# EAGLE schematic 13thISE.ver1 (EAGLE 9.6.2)
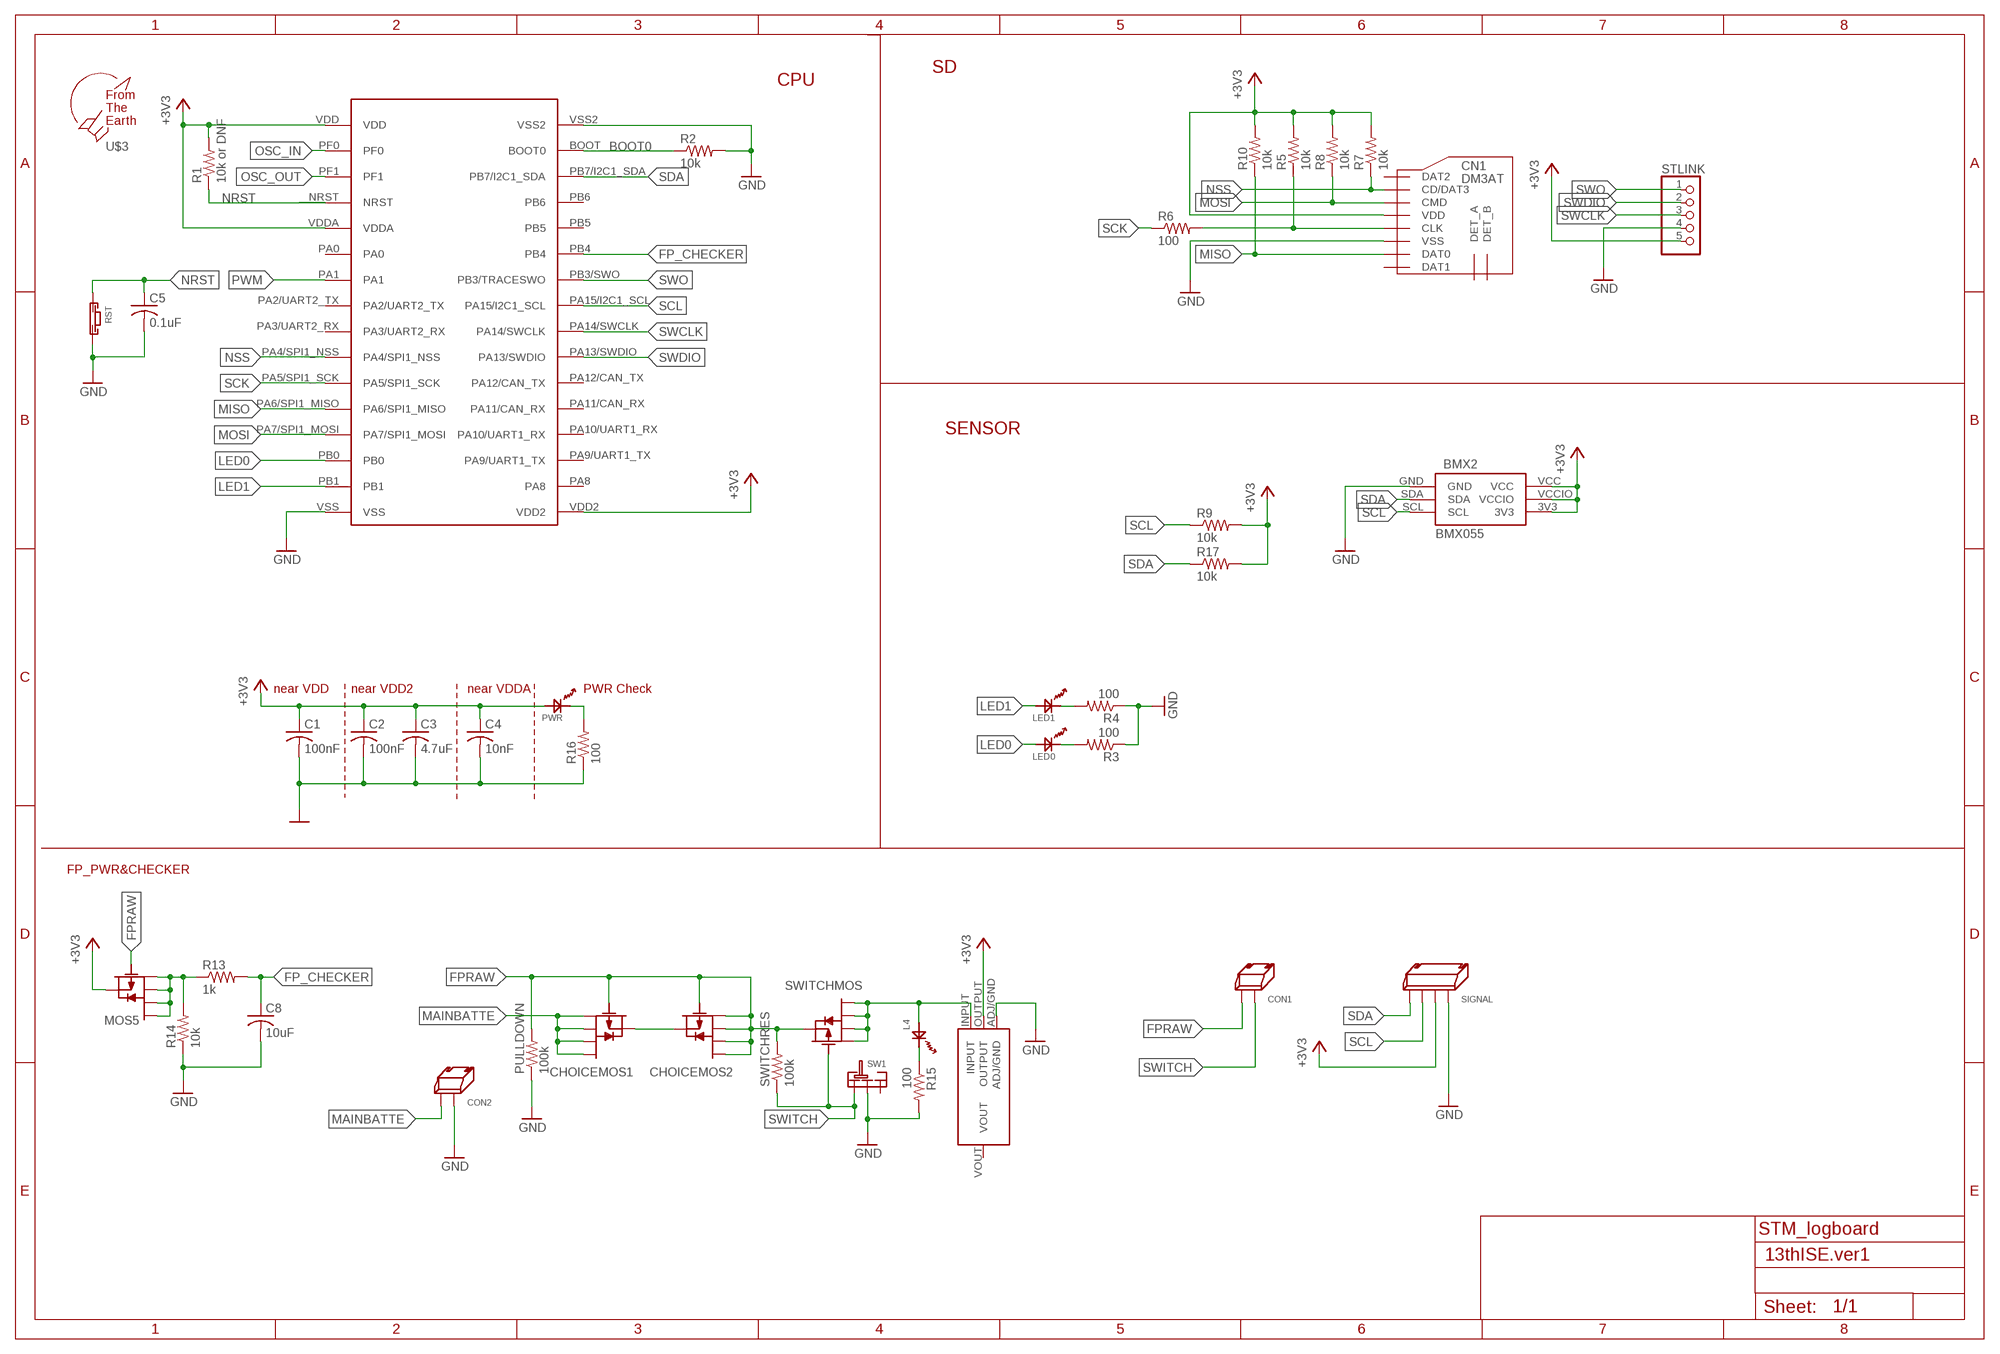
[diagram p0: schematic, sheet 1]

## Parts
BMX2  BMX055  [BMX055]
C1  100nF  C-USC1608  [C1608]
C2  100nF  C-USC1608  [C1608]
C3  4.7uF  C-USC1608  [C1608]
C4  10nF  C-USC1608  [C1608]
C5  0.1uF  C-USC1608  [C1608]
C8  10uF  C-USC0603  [C0603]
CHOICEMOS1  PCH_SSM6J808R  [SSM6J808R]
CHOICEMOS2  PCH_SSM6J808R  [SSM6J808R]
CN1  DM3AT  [DM3AT]
CON1  2PIN_SIDE  [2PIN_SIDE]
CON2  2PIN_SIDE  [2PIN_SIDE]
L4  OSXX1608C1A  [OSXX1608C1A]
LED0  OSXX1608C1A  [OSXX1608C1A]
LED1  OSXX1608C1A  [OSXX1608C1A]
MOS5  PCH_SSM6J808R  [SSM6J808R]
PULLDOWN  100k  R-US_R0603  [R0603]
PWR  OSXX1608C1A  [OSXX1608C1A]
R1  10k or DNF  R-US_R0603  [R0603]
R2  10k  R-US_R0603  [R0603]
R3  100  R-US_R0603  [R0603]
R4  100  R-US_R0603  [R0603]
R5  10k  R-US_R0603  [R0603]
R6  100  R-US_R0603  [R0603]
R7  10k  R-US_R0603  [R0603]
R8  10k  R-US_R0603  [R0603]
R9  10k  R-US_R0603  [R0603]
R10  10k  R-US_R0603  [R0603]
R13  1k  R-US_R0603  [R0603]
R14  10k  R-US_R0603  [R0603]
R15  100  R-US_R0603  [R0603]
R16  100  R-US_R0603  [R0603]
R17  10k  R-US_R0603  [R0603]
RST  TVAF06-A020B-R  [TVAF06-A020B-R]
SIGNAL  4PIN_SIDE  [4PIN_SIDE]
STLINK  PINHD-1X5/90  [1X05/90]
SW1  SRIDE_SWITCH  [SRIDE_SWITCH]
SWITCHMOS  PCH_SSM6J808R  [SSM6J808R]
SWITCHRES  100k  R-US_R0603  [R0603]
U$1  STM32F303K8  [STM32F303K8]
U$3  F.T.E.LOGO  [LOGO]
U$4  AZ1117C  [AZ1117C]

## Nets
+3V3: BMX2.3V3 BMX2.VCC BMX2.VCCIO C1.1 C2.1 C3.1 C4.1 CN1.VDD MOS5.4 PWR.AN R1.2 R5.2 R7.2 R8.2 R9.2 R10.2 R17.2 SIGNAL.P$3 STLINK.5 U$1.VDD U$1.VDD2 U$1.VDDA U$4.OUTPUT
BOOT0: R2.1 U$1.BOOT(BOOT0)
FP_CHECKER: C8.1 R13.2 U$1.PB4
FPRAW: CHOICEMOS1.3 CHOICEMOS2.1 CHOICEMOS2.2 CHOICEMOS2.3 CHOICEMOS2.5 CHOICEMOS2.6 CON1.P$2 MOS5.3 PULLDOWN.2 SWITCHMOS.4 SWITCHRES.2
GND: BMX2.GND C1.2 C2.2 C3.2 C4.2 C5.2 C8.2 CN1.VSS CON2.P$1 PULLDOWN.1 R2.2 R3.1 R4.1 R14.1 R15.2 R16.1 RST.P$2 SIGNAL.P$4 STLINK.4 SW1.LR U$1.VSS U$1.VSS2 U$4.ADJ/GND
LED0: LED0.AN U$1.PB0
LED1: LED1.AN U$1.PB1
MAINBATTE: CHOICEMOS1.1 CHOICEMOS1.2 CHOICEMOS1.5 CHOICEMOS1.6 CON2.P$2
MISO: CN1.DAT0 R10.1 U$1.PA6/SPI1_MISO
MOSI: CN1.CMD R8.1 U$1.PA7/SPI1_MOSI
N$1: U$1.NRST
N$2: PWR.CT R16.2
N$3: LED0.CT R3.2
N$4: LED1.CT R4.2
N$6: CN1.CLK R5.1 R6.2
N$10: CHOICEMOS1.4 CHOICEMOS2.4
N$11: L4.AN SWITCHMOS.1 SWITCHMOS.2 SWITCHMOS.5 SWITCHMOS.6 U$4.INPUT
N$14: MOS5.1 MOS5.2 MOS5.5 MOS5.6 R13.1 R14.2
N$16: L4.CT R15.1
NRST: C5.1 R1.1 RST.P$1
NSS: CN1.CD/DAT3 R7.1 U$1.PA4/SPI1_NSS
OSC_IN: U$1.PF0
OSC_OUT: U$1.PF1
PWM: U$1.PA1
SCK: R6.1 U$1.PA5/SPI1_SCK
SCL: BMX2.SCL R9.1 SIGNAL.P$1 U$1.PA15/I2C1_SCL
SDA: BMX2.SDA R17.1 SIGNAL.P$2 U$1.PB7/I2C1_SDA
SWCLK: STLINK.3 U$1.PA14/SWCLK
SWDIO: STLINK.2 U$1.PA13/SWDIO
SWITCH: CON1.P$1 SW1.L SWITCHMOS.3 SWITCHRES.1
SWO: STLINK.1 U$1.PB3/SWO(PB3/TRACESWO)
Unconnected: CN1.DAT1 CN1.DAT2 CN1.DET_A CN1.DET_B SW1.R U$1.PA0 U$1.PA2/UART2_TX U$1.PA3/UART2_RX U$1.PA8 U$1.PA9/UART1_TX U$1.PA10/UART1_RX U$1.PA11/CAN_RX U$1.PA12/CAN_TX U$1.PB5 U$1.PB6 U$4.VOUT

## Notes on the sheet
- SD
- CPU
- SENSOR
- near VDD | near VDD2 | near VDDA | PWR Check
- FP_PWR&CHECKER
- STM_logboard

## Library data of the parts
BMX2 = BMX055:BMX055
C1-C5 C8 = rcl:C-US: CAPACITOR, American symbol; SPICEPREFIX: C
CHOICEMOS1 CHOICEMOS2 MOS5 SWITCHMOS = Chip MOSFET:PCH_SSM6J808R
CN1 = microSD:DM3AT
CON1 CON2 = XR Connector:2PIN_SIDE
L4 LED0 LED1 PWR = Chip LED:OSXX1608C1A
PULLDOWN R1-R10 R13-R17 SWITCHRES = rcl:R-US_: RESISTOR, American symbol; SPICEPREFIX: R
RST = Tact switch:TVAF06-A020B-R
SIGNAL = XR Connector:4PIN_SIDE
STLINK = pinhead:PINHD-1X5: PIN HEADER
SW1 = Sride Switch:SRIDE_SWITCH
U$1 = STM32F303K8:STM32F303K8
U$3 = logo:F.T.E.LOGO
U$4 = AZ1117C:AZ1117C